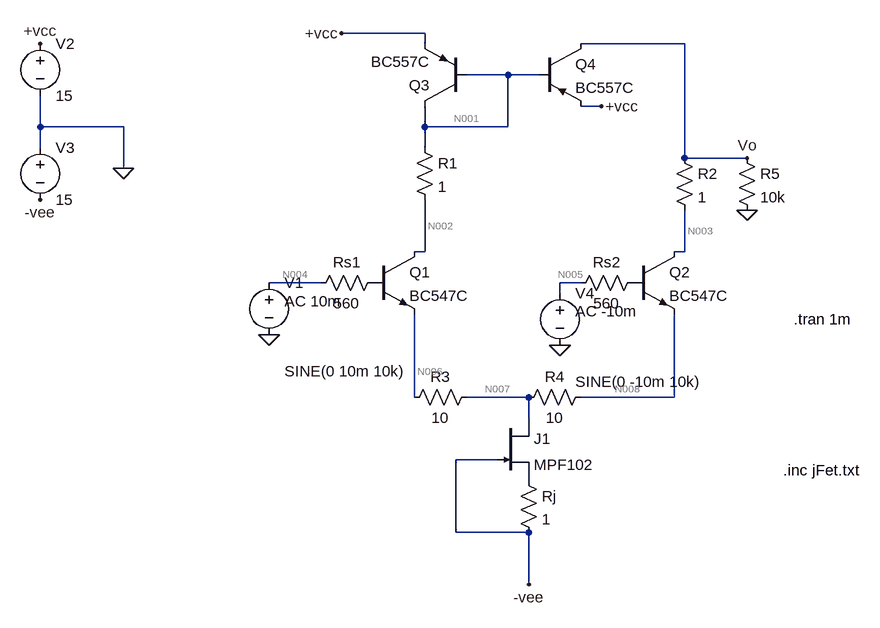
[diagram p0: schematic Eldiego.asc]
Eldiego.asc, the LTspice schematic file:
Version 4
SHEET 1 2088 752
WIRE 16 -208 -96 -208
WIRE 32 -208 16 -208
WIRE 32 -192 32 -208
WIRE 336 -192 272 -192
WIRE 432 -192 336 -192
WIRE 160 -144 96 -144
WIRE 208 -144 160 -144
WIRE 304 -96 272 -96
WIRE -560 -64 -560 -112
WIRE -432 -64 -560 -64
WIRE 32 -64 32 -96
WIRE 160 -64 160 -144
WIRE 160 -64 32 -64
WIRE 32 -48 32 -64
WIRE -560 -32 -560 -64
WIRE 32 -32 32 -48
WIRE 432 -16 432 -192
WIRE 528 -16 432 -16
WIRE -432 0 -432 -64
WIRE 32 128 32 48
WIRE 32 128 16 128
WIRE 432 128 432 64
WIRE 432 128 416 128
WIRE -128 176 -208 176
WIRE 272 176 240 176
WIRE 240 192 240 176
WIRE 16 272 16 224
WIRE 16 352 16 272
WIRE 192 352 96 352
WIRE 416 352 416 224
WIRE 416 352 272 352
WIRE 192 384 192 352
WIRE 144 448 80 448
WIRE 80 560 80 448
WIRE 192 560 80 560
WIRE 192 608 192 560
WIRE 192 640 192 608
FLAG 240 272 0
FLAG -208 256 0
FLAG -96 -208 +vcc
FLAG 192 640 -vee
FLAG 528 -16 Vo
FLAG -432 0 0
FLAG -560 -192 +vcc
FLAG -560 48 -vee
FLAG 304 -96 +vcc
FLAG 528 64 0
DATAFLAG 16 272 ""
DATAFLAG 16 -208 ""
DATAFLAG 336 -192 ""
DATAFLAG 32 -48 ""
DATAFLAG 192 608 ""
SYMBOL npn -48 128 R0
SYMATTR InstName Q1
SYMATTR Value BC547C
SYMBOL npn 352 128 R0
SYMATTR InstName Q2
SYMATTR Value BC547C
SYMBOL pnp 96 -96 R180
SYMATTR InstName Q3
SYMATTR Value BC557C
SYMBOL pnp 208 -192 R0
SYMATTR InstName Q4
SYMATTR Value BC557C
SYMBOL njf 144 384 R0
SYMATTR InstName J1
SYMATTR Value MPF102
SYMBOL voltage -208 160 R0
WINDOW 3 24 152 Left 2
WINDOW 123 24 44 Left 2
WINDOW 39 0 0 Left 2
SYMATTR Value SINE(0 10m 10k)
SYMATTR Value2 AC 10m
SYMATTR InstName V1
SYMBOL voltage 240 176 R0
WINDOW 3 24 152 Left 2
WINDOW 123 24 44 Left 2
WINDOW 39 0 0 Left 2
SYMATTR Value SINE(0 -10m 10k)
SYMATTR Value2 AC -10m
SYMATTR InstName V4
SYMBOL res 368 160 R90
WINDOW 0 0 56 VBottom 2
WINDOW 3 32 56 VTop 2
SYMATTR InstName Rs2
SYMATTR Value 560
SYMBOL res -32 160 R90
WINDOW 0 0 56 VBottom 2
WINDOW 3 32 56 VTop 2
SYMATTR InstName Rs1
SYMATTR Value 560
SYMBOL res 176 464 R0
SYMATTR InstName Rj
SYMATTR Value 1
SYMBOL voltage -560 -208 R0
WINDOW 123 0 0 Left 2
WINDOW 39 0 0 Left 2
SYMATTR InstName V2
SYMATTR Value 15
SYMBOL voltage -560 -48 R0
SYMATTR InstName V3
SYMATTR Value 15
SYMBOL res 16 -48 R0
SYMATTR InstName R1
SYMATTR Value 1
SYMBOL res 416 -32 R0
SYMATTR InstName R2
SYMATTR Value 1
SYMBOL res 112 336 R90
WINDOW 0 0 56 VBottom 2
WINDOW 3 32 56 VTop 2
SYMATTR InstName R3
SYMATTR Value 10
SYMBOL res 288 336 R90
WINDOW 0 0 56 VBottom 2
WINDOW 3 32 56 VTop 2
SYMATTR InstName R4
SYMATTR Value 10
SYMBOL res 512 -32 R0
SYMATTR InstName R5
SYMATTR Value 10k
TEXT 584 464 Left 2 !.inc jFet.txt
TEXT 600 232 Left 2 !.tran 1m

The netlist it stands for:
* Eldiego.asc
Q1 N002 P001 N006 0 BC547C
Q2 N003 P002 N008 0 BC547C
Q3 N001 N001 +vcc 0 BC557C
Q4 Vo N001 +vcc 0 BC557C
J1 N007 -vee P003 MPF102
V1 N004 0 SINE(0 10m 10k) AC 10m
V4 N005 0 SINE(0 -10m 10k) AC -10m
Rs2 P002 N005 560
Rs1 P001 N004 560
Rj P003 -vee 1
V2 +vcc 0 15
V3 0 -vee 15
R1 N001 N002 1
R2 Vo N003 1
R3 N007 N006 10
R4 N008 N007 10
R5 Vo 0 10k
.model NPN NPN
.model PNP PNP
.lib standard.bjt
.model NJF NJF
.model PJF PJF
.lib standard.jft
.inc jFet.txt
.tran 1m
.backanno
.end

* Results of the author's LTspice run, read from the files saved beside the schematic
* Operating Point, zero values left out:
*   V(n002) = 14.32 V
*   V(p001) = -6.172 mV
*   V(n006) = -671.4 mV
*   V(n003) = 10.29 V
*   V(p002) = -6.436 mV
*   V(n008) = -672.7 mV
*   V(n001) = 14.33 V
*   V(+vcc) = 15 V
*   V(vo) = 10.3 V
*   V(n007) = -733.4 mV
*   V(-vee) = -15 V
*   V(p003) = -14.99 V
*   Ic(Q4) = -7.082 mA
*   Ib(Q4) = -14.42 µA
*   Ie(Q4) = 7.096 mA
*   Ic(Q3) = -6.156 mA
*   Ib(Q3) = -14.71 µA
*   Ie(Q3) = 6.17 mA
*   Ic(Q2) = 6.052 mA
*   Ib(Q2) = 11.49 µA
*   Ie(Q2) = -6.063 mA
*   Ic(Q1) = 6.185 mA
*   Ib(Q1) = 11.02 µA
*   Ie(Q1) = -6.196 mA
*   Id(J1) = 12.26 mA
*   Ig(J1) = -15.33 pA
*   Is(J1) = -12.26 mA
*   I(R5) = 1.03 mA
*   I(R4) = 6.063 mA
*   I(R3) = -6.196 mA
*   I(R2) = 6.052 mA
*   I(R1) = 6.185 mA
*   I(Rj) = 12.26 mA
*   I(Rs1) = -11.02 µA
*   I(Rs2) = -11.49 µA
*   I(V3) = -12.26 mA
*   I(V2) = -13.27 mA
*   I(V4) = -11.49 µA
*   I(V1) = -11.02 µA
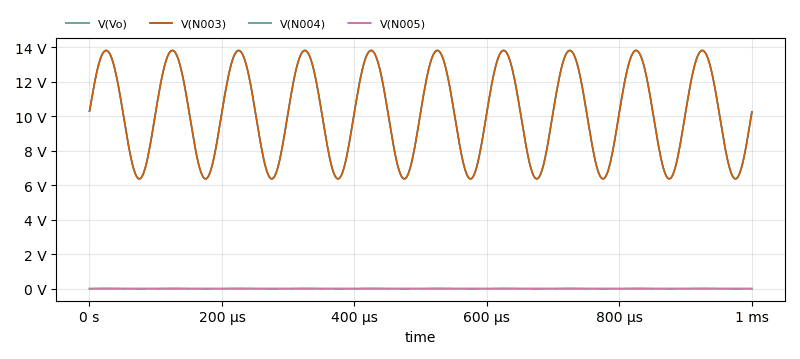
[diagram p1: Transient Analysis of Eldiego.asc, plotted from the saved traces]
* Transient Analysis, 1 run:
*   V(Vo): min 6.37 V, max 13.81 V, average 10.19 V, rms 10.53 V, last 10.25 V
*   V(N003): min 6.363 V, max 13.81 V, average 10.19 V, rms 10.52 V, last 10.24 V
*   V(N004): min -9.99 mV, max 9.99 mV, average -813.1 nV, rms 7.085 mV, last 0 V
*   V(N005): min -9.99 mV, max 9.99 mV, average 813.1 nV, rms 7.085 mV, last 0 V